# EAGLE design Power Track (EAGLE 9.7.0)
Assembly variants: Production
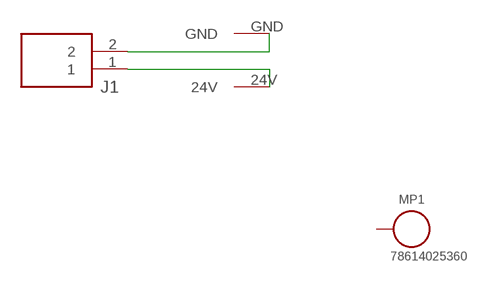
[diagram p0: schematic, sheet 1]

## Parts
CONTACT_PADS  POWERTRACKPAD  [POWER-TRACK-PADS]  (not fitted in variant Production)
J1  2200980271  220098-0271  [2200980271]
MP1  78614025360  WE-SMSA_3.3MMDEFAULT  [WE-SMSA_78614020360]

## Nets
24V: CONTACT_PADS.24V J1.1
GND: CONTACT_PADS.GND J1.2
Unconnected: MP1.1 MP1.2 MP1.3 MP1.4

## Library data of the parts
CONTACT_PADS = Power Track Pads:POWERTRACKPAD
J1 = molex-right-angle-220098-0271:220098-0271: 1.25WB MLP SGL RA TH ASSY 2CKT B; DATASHEET: https://www.molex.com/en-us/products/part-detail-pdf/2200980271?display=pdf; MANUFACTURER: Molex; MPN: 2200980271
MP1 = ROUND SPACER M3 STEEL 2.50MM:WE-SMSA_3.3MM: Round Spacer Threaded M3 Steel 0.098in (2.50mm); DATASHEET: https://www.we-online.com/components/products/datasheet/78614025360.pdf; MANUFACTURER: Würth Elektronik; MPN: 78614025360

## Board
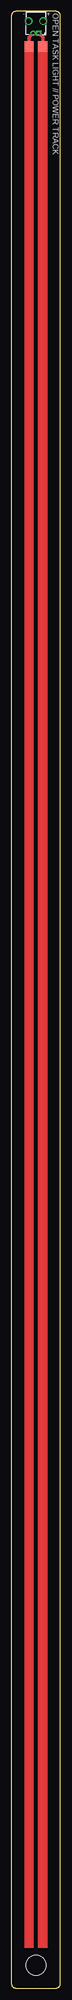
[diagram p1: board, top side]
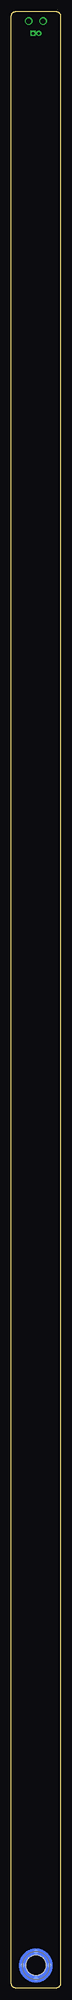
[diagram p2: board, bottom side, seen from below]

Size 10.8 x 432 mm. Coordinates in mm from the lower left corner, seen from the top.
Outline: 0,431 0,1 arc90 1,0 9.8,0 arc90 10.8,1 10.8,431 arc90 9.8,432 1,432 arc90 0,431
Copper layers (1*16): Top 0.035mm / dielectric 1.5mm / Bottom 0.035mm
Design rules "Fusion Electronics Design Rules *": minimum track width 6mil, minimum drill 0.35mm, track to track 6mil, track to pad 0mil, pad to pad 6mil, via to via 6mil, smd to smd 6mil, copper to edge 40mil, drill to drill 6mil, minimum pad ring 10mil, minimum via ring 8mil, stop-mask expansion 4mil, vias tented up to drill 9999mil, thermal gap 10mil

### Footprints (pad centres in the part's own frame; a part is rotated, then mirrored left to right if it is on the bottom)
POWER-TRACK-PADS = smd 2.032 x 2.286: 24V 1.524,-1.143; GND -1.524,-1.143
2200980271 = drill 0.6 pad 1 square: 1 -0.625,2.8 | drill 0.6 pad 1: 2 0.625,2.8 | drill 1.092 pad 1.092: 3 1.575,0.1; 4 -1.575,0.1
WE-SMSA_78614020360 = smd 1 x 1: 1 2.95,0; 2 0,2.95; 3 -2.95,0; 4 0,-2.95 | hole 4.4: 0,0

### Placement (x,y rotation side)
CONTACT_PADS  5.4,425.5 0 top
J1  5.4,430 180 top
MP1  5.4,4.94 180 bottom

### Tracks (layer width: path | path; a pad name or v marks a point on that pad's centre or on a via)
24V
  Top 0.813: J1.1 6.9,426.32 CONTACT_PADS.24V
GND
  Top 0.813: J1.2 3.9,426.32 CONTACT_PADS.GND

### Text on the board
tPlace: OPEN TASK LIGHT // POWER TRACK | - | +